# EasyEDA Pro project PrototypeBoardV2D.eprj

# Schematic Schematic1
Board Name: Board1; Create Date: 2025-06-25; Page Name: P1; Project Name: PrototypeBoardV2D; Schematic Name: Schematic1; Update Date: 2025-12-08; Company: m039; Drawn: Dmitry Mozgin; Page Size: A4; Version: V1.0
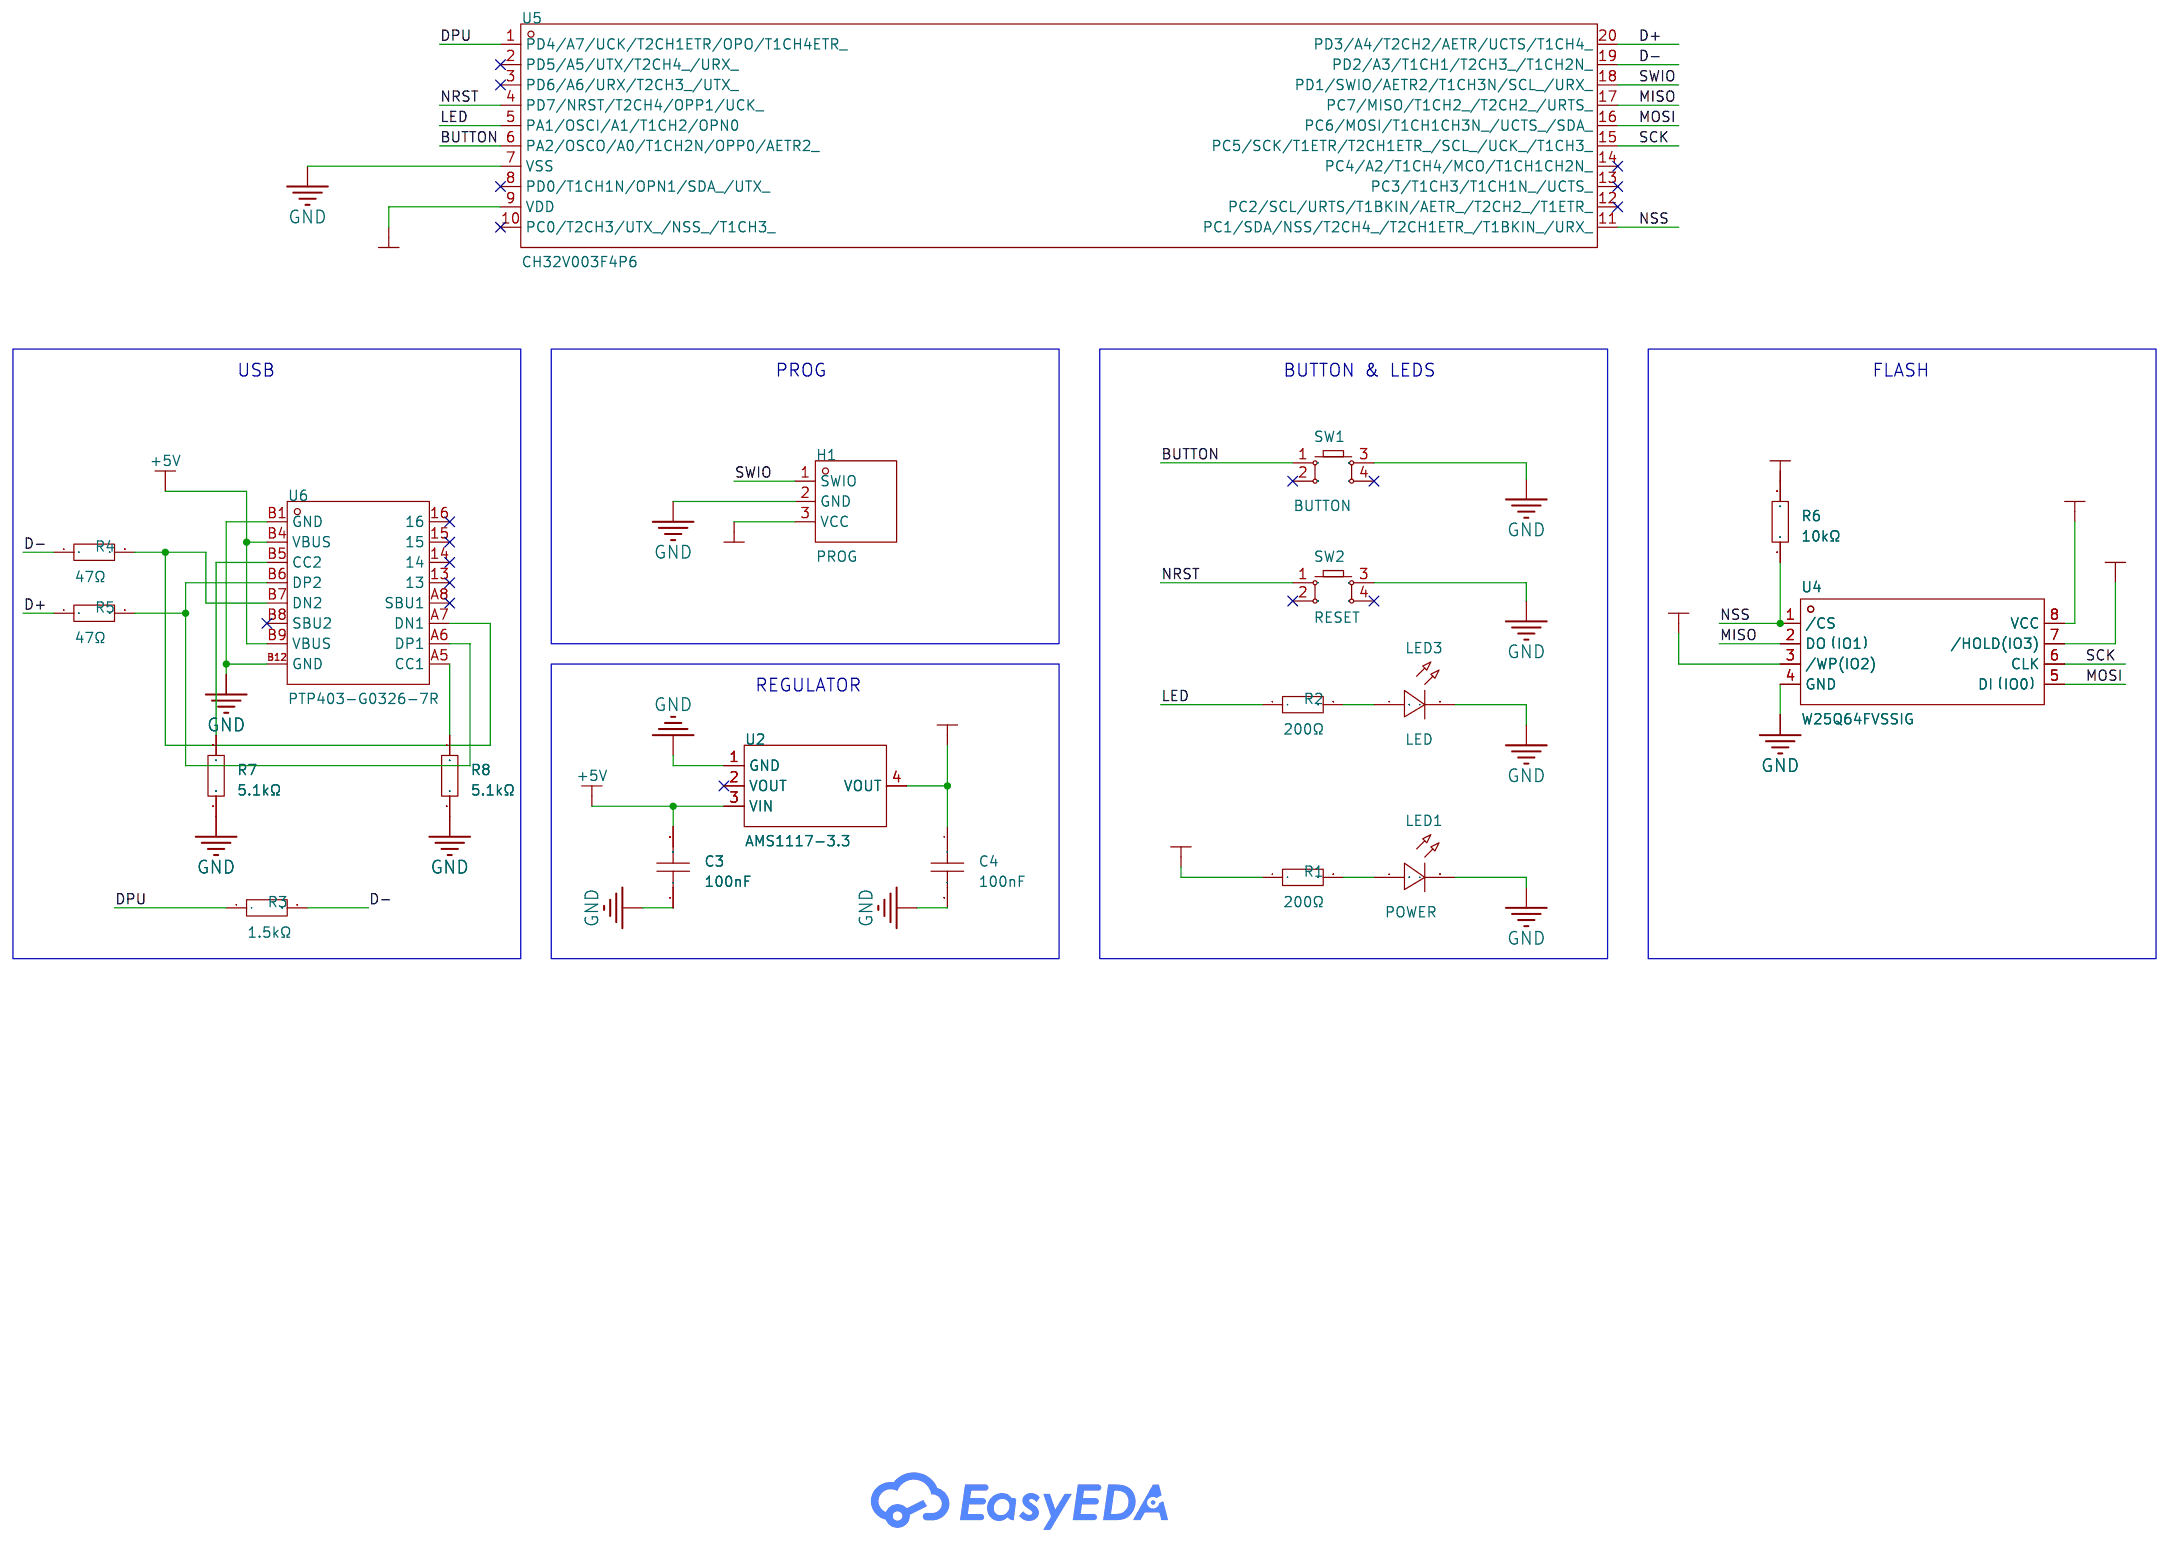
[diagram p0: schematic sheet]

## Parts
C3  100nF  [C0805]
C4  100nF  [C0805]
H1  PROG  [HDR-TH_3P-P2.54-V-M]
LED1  POWER  [LED-TH_BD3.0-P2.54-FD]
LED3  LED  [LED-TH_BD3.8-P2.54-FD_BLUE]
R1  200Ω  [R1206]
R2  200Ω  [R1206]
R3  1.5kΩ  [R1206]
R4  47Ω  [R1206]
R5  47Ω  [R1206]
R6  10kΩ  [R1206]
R7  5.1kΩ  [R1206]
R8  5.1kΩ  [R1206]
SW1  BUTTON  [KEY-TH_4P-L6.0-W6.0-P3.90-LS6.5]
SW2  RESET  [KEY-TH_4P-L6.0-W6.0-P3.90-LS6.5]
U2  AMS1117-3.3  [SOT-223-3_L6.5-W3.4-P2.30-LS7.0-BR]
U4  W25Q64FVSSIG  [SOIC-8_L5.3-W5.3-P1.27-LS8.0-BL]
U5  CH32V003F4P6  [TSSOP-20_L6.5-W4.4-P0.65-LS6.4-BL]
U6  PTP403-G0326-7R  [USB-SMD_PTP403-G0326-7R]

## Library data of the parts
C3 C4 = CAP_0805: Supplier Footprint: 0805
H1 = HDR-M_2.54_1x3P: Supplier Footprint: Through
LED1 = LED_TH-R_3mm: Supplier Footprint: Through
LED3 = LED_TH-B_3mm: Supplier Footprint: Through
R1-R8 = Res_1206: Supplier Footprint: 1206
SW1 SW2 = Key_TH_6x6x4.5: Supplier Footprint: Through
U2 = AMS1117-3.3_C6186: LCSC Part Name: 输出3.3V 1A; Supplier Part: C6186; Manufacturer: AMS; Supplier Footprint: SOT-223; JLCPCB Part Class: Basic Part; Datasheet: https://atta.szlcsc.com/upload/public/pdf/source/20180727/C6186_7A095716F0823C02F1997A905E26C086.pdf; Supplier: LCSC; Output Type: Fixed; Voltage - Supply: 16V; Output Voltage: 3.3V; Output Current: 1A; Power Supply Rejection Ratio (PSRR): 72dB@(120Hz); Voltage Dropout: 1.1V@(800mA); standby current: 5mA; Features: Over Current Protection；Over Temperature Protection; Operating Temperature: -40℃~+125℃; Output Configuration: Positive; Number of Outputs: 1
U4 = W25Q64FVSSIG: LCSC Part Name: W25Q64FVSSIG 停产; Supplier Part: C66141; Supplier Footprint: SOIC-8-208mil; JLCPCB Part Class: Extended Part; Supplier: LCSC
U5 = CH32V003F4P6: Supplier Part: C5187096; Manufacturer: WCH(南京沁恒); Supplier Footprint: TSSOP-20-175mil; JLCPCB Part Class: Extended Part; Datasheet: https://atta.szlcsc.com/upload/public/pdf/source/20250604/86DFE64B14CD7099775DB96D45CE90A6.pdf; Supplier: LCSC
U6 = USB Type-C 16P: Supplier Part: C9900000187; Supplier Footprint: USB3-TYPEC-16PIN-COM; JLCPCB Part Class: Extended Part; Supplier: LCSC

## Nets
+3.3V: C4.1 H1.3(VCC) R1.1 R6.2 U2.4(VOUT) U4.3(/WP(IO2)) U4.7(/HOLD(IO3)) U4.8(VCC) U5.9(VDD)
+5V: C3.2 U2.3(VIN) U6.B4(VBUS) U6.B9(VBUS)
GND: C3.1 C4.2 H1.2(GND) LED1.2(A) LED3.2(A) R7.1 R8.1 SW1.3 SW2.3 U2.1(GND) U4.4(GND) U5.7(VSS) U6.B1(GND) U6.B12(GND)
BUTTON: SW1.1 U5.6(PA2/OSCO/A0/T1CH2N/OPP0/AETR2_)
D+: R5.1 U5.20(PD3/A4/T2CH2/AETR/UCTS/T1CH4_)
D-: R3.2 R4.1 U5.19(PD2/A3/T1CH1/T2CH3_/T1CH2N_)
DPU: R3.1 U5.1(PD4/A7/UCK/T2CH1ETR/OPO/T1CH4ETR_)
LED: R2.1 U5.5(PA1/OSCI/A1/T1CH2/OPN0)
MISO: U4.2(DO（IO1）) U5.17(PC7/MISO/T1CH2_/T2CH2_/URTS_)
MOSI: U4.5(DI（IO0）) U5.16(PC6/MOSI/T1CH1CH3N_/UCTS_/SDA_)
NRST: SW2.1 U5.4(PD7/NRST/T2CH4/OPP1/UCK_)
NSS: R6.1 U4.1(/CS) U5.11(PC1/SDA/NSS/T2CH4_/T2CH1ETR_/T1BKIN_/URX_)
SCK: U4.6(CLK) U5.15(PC5/SCK/T1ETR/T2CH1ETR_/SCL_/UCK_/T1CH3_)
SWIO: H1.1(SWIO) U5.18(PD1/SWIO/AETR2/T1CH3N/SCL_/URX_)
$1N1276: LED1.1(C) R1.2
$1N2333: LED3.1(C) R2.2
$1N3479: R4.2 U6.A7(DN1) U6.B7(DN2)
$1N3509: R5.2 U6.A6(DP1) U6.B6(DP2)
$1N6961: R8.2 U6.A5(CC1)
Net-(R7-2): R7.2 U6.B5(CC2)

Not connected (* = marked no-connect by the designer): SW1 2* 4*; SW2 2* 4*; U2 2(VOUT)*; U5 2(PD5/A5/UTX/T2CH4_/URX_)* 3(PD6/A6/URX/T2CH3_/UTX_)* 8(PD0/T1CH1N/OPN1/SDA_/UTX_)* 10(PC0/T2CH3/UTX_/NSS_/T1CH3_)* 12(PC2/SCL/URTS/T1BKIN/AETR_/T2CH2_/T1ETR_)* 13(PC3/T1CH3/T1CH1N_/UCTS_)* 14(PC4/A2/T1CH4/MCO/T1CH1CH2N_)*; U6 13* 14* 15* 16* A8(SBU1)* B8(SBU2)*

## Notes on the sheet
- USB
- PROG
- BUTTON & LEDS
- FLASH
- REGULATOR

# Board PCB1
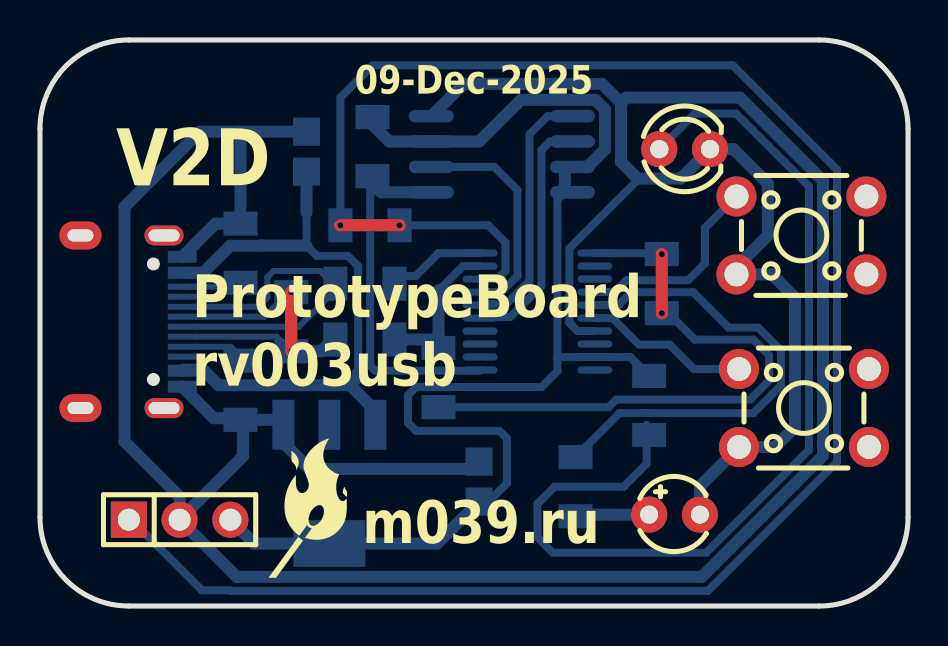
[diagram p1: board, top side]
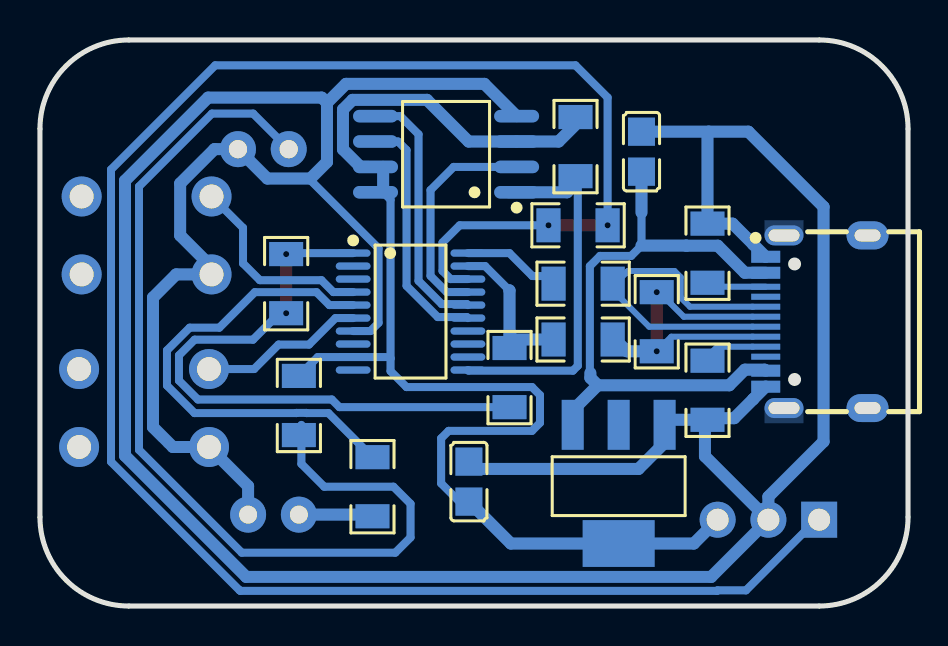
[diagram p2: board, bottom side, seen from below]

Outline 43.44 x 28.32 mm; copper layers: Top Layer, Bottom Layer. Coordinates in mm from the lower left corner of the outline.
Outline path: 0,23.88 0,4.45 arc(1.3,1.3) 4.45,0 38.99,0 arc(42.13,1.3) 43.44,4.45 43.44,23.88 arc(42.13,27.02) 38.99,28.32 4.45,28.32 arc(1.3,27.02) 0,23.88
Stack: Top Layer 0.035mm / Dielectric1 1.51mm FR4 er 4.5 / Bottom Layer 0.035mm

## Design rules (mm)
template: Custom Config
spacing copperThickness1oz (default): track to track 0.2, other pairs 0.152 to 0.3
spacing copperThickness2oz: track to track 0.203, other pairs 0.152 to 0.3
track width copperThickness1oz (default): min 0.127, default 0.6, max 2.54
track width copperThickness2oz: min 0.203, default 0.254, max 2.54
differential pair differentialPair (default): width min 0.127, default 0.254, max 2.54; gap min 0.152, default 0.152
via viaSize (default): diameter min 0.5, default 0.61, max 10; hole min 0.3, default 0.305, max 6.3

## Placement (name value [footprint] x y rotation side)
C3  100nF  [C0805]  13.34 22.73 270 bottom
C4  100nF  [C0805]  21.97 6.22 90 bottom
H1  PROG  [HDR-TH_3P-P2.54-V-M]  6.99 4.32 0 top
LED1  POWER  [LED-TH_BD3.0-P2.54-FD]  32.26 22.86 0 top
LED3  LED  [LED-TH_BD3.8-P2.54-FD_BLUE]  31.75 4.57 0 top
R1  200Ω  [R1206]  30.48 10.03 270 bottom
R2  200Ω  [R1206]  26.8 5.97 270 bottom
R3  1.5kΩ  [R1206]  19.94 11.43 90 bottom
R4  47Ω  [R1206]  16.26 13.34 180 bottom
R5  47Ω  [R1206]  16.26 16.13 180 bottom
R6  10kΩ  [R1206]  16.64 22.99 90 bottom
R7  5.1kΩ  [R1206]  16.51 19.05 0 bottom
R7#2  -  [R1206]  12.57 14.23 270 bottom
R7#3  -  [R1206]  10.03 17.65 270 bottom
R7#4  -  [R1206]  31.12 16.13 90 bottom
R8  5.1kΩ  [R1206]  10.03 10.8 90 bottom
SW1  BUTTON  [KEY-TH_4P-L6.0-W6.0-P3.90-LS6.5]  38.23 9.91 0 top
SW2  RESET  [KEY-TH_4P-L6.0-W6.0-P3.90-LS6.5]  38.1 18.54 0 top
U2  AMS1117-3.3  [SOT-223-3_L6.5-W3.4-P2.30-LS7.0-BR]  14.48 6.1 90 bottom
U4  W25Q64FVSSIG  [SOIC-8_L5.3-W5.3-P1.27-LS8.0-BL]  23.12 22.61 90 bottom
U5  CH32V003F4P6  [TSSOP-20_L6.5-W4.4-P0.65-LS6.4-BL]  24.89 14.73 270 bottom
U6  PTP403-G0326-7R  [USB-SMD_PTP403-G0326-7R]  4.57 14.23 90 bottom

## Footprints (pads in the part's own frame, mm; a bottom-side part is the same pattern mirrored in y, then rotated)
C0805
  rect 1.41x1.35 smd: 1(-1,0) 2(1,0)
HDR-TH_3P-P2.54-V-M
  rect 1.8x1.8 hole 1.1: 1(-2.54,0)
  round 1.8 hole 1.1x0.9: 2(0,0) 3(2.54,0)
KEY-TH_4P-L6.0-W6.0-P3.90-LS6.5
  round 2 hole 1.2: 1(-3.25,1.95) 2(3.25,1.95) 3(-3.25,-1.95) 4(3.25,-1.95)
LED-TH_BD3.0-P2.54-FD
  round 1.8 hole 0.914x0.9: 1(-1.27,0) 2(1.27,0)
LED-TH_BD3.8-P2.54-FD_BLUE
  round 1.8 hole 0.9: 1(-1.27,0) 2(1.27,0)
R1206
  rect 1.208x1.701 smd: 1(-1.479,0) 2(1.479,0)
SOIC-8_L5.3-W5.3-P1.27-LS8.0-BL
  oval 0.63x2.25 smd: 1(-1.905,-3.53) 2(-0.635,-3.53) 3(0.635,-3.53) 4(1.905,-3.53) 5(1.905,3.53) 6(0.635,3.53) 7(-0.635,3.53) 8(-1.905,3.53)
SOT-223-3_L6.5-W3.4-P2.30-LS7.0-BR
  rect 2.5x1.1 smd: 1(2.97,-2.3) 2(2.97,0) 3(2.97,2.3)
  rect 2.34x3.6 smd: 4(-2.97,0)
TSSOP-20_L6.5-W4.4-P0.65-LS6.4-BL
  oval 0.364x1.742 smd: 1(-2.925,-2.871) 2(-2.275,-2.871) 3(-1.625,-2.871) 4(-0.975,-2.871) 5(-0.325,-2.871) 6(0.325,-2.871) 7(0.975,-2.871) 8(1.625,-2.871) 9(2.275,-2.871) 10(2.925,-2.871) 11(2.925,2.871) 12(2.275,2.871) 13(1.625,2.871) 14(0.975,2.871) 15(0.325,2.871) 16(-0.325,2.871) 17(-0.975,2.871) 18(-1.625,2.871) 19(-2.275,2.871) 20(-2.925,2.871)
USB-SMD_PTP403-G0326-7R
  oval 1x1.95 hole 0.6x1.55: 13(-4.32,1.633) 14(4.32,1.633)
  oval 1.4x2.1 hole 0.6x1.3: 15(-4.32,-2.547) 16(4.32,-2.547)
  rect 0.3x1.45 smd: A5(-1.25,2.547) A6(-0.25,2.547) A7(0.25,2.547) A8(1.25,2.547) B5(1.75,2.547) B6(0.75,2.547) B7(-0.75,2.547) B8(-1.75,2.547)
  rect 0.6x1.45 smd: B1(3.25,2.547) B4(2.45,2.547) B9(-2.45,2.547) B12(-3.25,2.547)

## Nets
+3.3V: C4.1 H1.3 R1.1 R6.2 U2.4 U4.3 U4.7 U4.8 U5.9
+5V: C3.2 U2.3 U6.B4 U6.B9
GND: C3.1 C4.2 H1.2 LED1.2 LED3.2 R7#3.1 R8.1 SW1.3 SW2.3 U2.1 U4.4 U5.7 U6.B1 U6.B12
BUTTON: SW1.1 U5.6
D+: R5.1 U5.20
D-: R3.2 R4.1 U5.19
DPU: R3.1 R7#4.1 R7#4.2 U5.1
LED: R2.1 U5.5
MISO: U4.2 U5.17
MOSI: U4.5 U5.16
NRST: SW2.1 U5.4
NSS: R6.1 U4.1 U5.11
SCK: U4.6 U5.15
SWIO: H1.1 R7.1 R7.2 U5.18
$1N1276: LED1.1 R1.2
$1N2333: LED3.1 R2.2
$1N3479: R4.2 R7#2.1 R7#2.2 U6.A7 U6.B7
$1N3509: R5.2 U6.A6 U6.B6
$1N6957: R7#3.2 U6.B5
$1N6961: R8.2 U6.A5

Pads without a net: SW1 2 4; SW2 2 4; U2 2; U5 2 3 8 10 12 13 14; U6 13 14 15 16 A8 B8

## Via types
v1: diameter 0.61, hole 0.305, Top Layer to Bottom Layer, 6 vias

## Routing (per net, layer and track width the routed paths; a pad name or vN(x,y) marks a point on that pad's centre or on a via; arc(x,y) is an arc through that point)
+3.3V: length 64.5
  Bottom Layer w0.4: 26.26,20.7 25.89,20.33 25.89,12.39 ; 25.89,12.39 25.89,11.75 25.1,10.96 18.82,10.96 18.42,10.56 18.42,9.16 18.82,8.76 22.99,8.76 23.36,8.39 23.36,6.14 22.45,5.22 C4.1 ; 25.89,12.39 25.96,12.46 U5.9 29.54,12.46 R1.1
  Bottom Layer w0.6: 16.64,24.09 17.48,23.24 U4.3 21.99,23.24 24.07,25.33 27.79,25.33 28.27,24.85 28.27,24.73 28.28,24.73 28.28,22.85 27.4,21.97 27.03,21.97 ; C4.1 19.88,3.13 10.72,3.13 H1.3 ; 26.26,20.7 26.26,21.97
+5V: length 30.8
  Bottom Layer w0.4: 15.92,11.69 15.92,17.01 15.41,17.52 13.85,17.52 13.34,18.04 13.34,19.69
  Bottom Layer w0.6: U2.3 16.78,9.79 15.52,11.05 ; 15.52,11.05 8.94,11.05 8.16,11.83 7.17,11.83 U6.B9 ; 15.52,11.05 15.9,11.42 15.9,11.66 ; U6.B4 8.17,16.68 9.52,18.03 11.09,18.03 11.1,18.04 13.34,18.04 ; C3.2 13.34,19.69
GND: length 175.8
  Bottom Layer w0.4: 29.9,21.31 26.49,17.9 26.49,14.17 26.9,13.76 U5.7
  Bottom Layer w0.6: 35.04,16.78 34.85,16.97 36.42,18.54 36.42,21.14 34.7,22.86 LED1.2 32.06,21.39 29.9,21.39 29.08,22.22 29.08,25.18 ; 9.98,23.73 10.03,23.68 R7#3.1 8.78,19.13 7.75,18.11 7.75,18.1 7.12,17.48 U6.B1 ; 9.98,23.73 7.99,23.73 4.23,19.98 4.23,8.23 6.99,5.47 H1.2 ; 9.98,23.73 C3.1 ; 10.16,9.32 10.08,9.4 8.7,9.4 7.75,10.35 7.75,10.35 7.12,10.98 U6.B12 ; 10.16,9.32 10.16,7.49 H1.2 ; 10.16,9.32 12.18,9.32 ; 10.16,9.32 R8.1 ; LED3.2 33.02,6 SW1.3 36.79,7.96 37.78,8.95 37.78,15.43 36.62,16.59 SW2.3 ; H1.2 9.85,1.46 33.12,1.46 39.18,7.52 39.18,21.28 35.02,25.44 29.34,25.44 29.08,25.18 ; U2.1 12.18,8.17 13.49,6.86 21.61,6.86 C4.2 ; U4.4 21.2,26.13 28.12,26.13 29.08,25.18
BUTTON: length 8.3
  Bottom Layer w0.4: U5.6 28.65,14.41 29.97,13.08 31.5,13.08 32.72,11.86 SW1.1
D+: length 4.9
  Bottom Layer w0.4: 17.61,16.51 18.8,16.51 19.94,17.66 U5.20
D-: length 7.4
  Bottom Layer w0.4: 19.95,15.8 21.16,17.01 U5.19
  Bottom Layer w0.6: 19.95,15.8 19.94,15.79 19.94,13.56 19.72,13.34 17.48,13.34
DPU: length 31.2
  Top Layer w0.6: v1(31.12,17.61) v1(31.12,14.65)
  Bottom Layer w0.4: 31.37,17.86 31.17,17.66 U5.1 ; R3.1 28.45,9.95 28.83,10.33 35.53,10.33 36.48,11.28 36.48,12.54 35.7,13.33 32.78,13.33 31.37,14.73 31.37,14.91
LED: length 24.3
  Bottom Layer w0.4: R2.1 29,9.65 30.1,9.65 30.11,9.66 30.6,9.66 30.61,9.65 35.7,9.65 37.08,11.03 37.08,12.79 35.95,13.93 34.46,13.93 32.69,15.7 29.6,15.7 28.95,15.06 U5.5
MISO: length 11.7
  Bottom Layer w0.4: U5.17 23.08,15.71 23.89,16.52 23.89,20.81 22.73,21.97 19.2,21.97
MOSI: length 12.5
  Bottom Layer w0.4: 26.26,24.51 25.4,24.51 24.49,23.6 24.49,16.27 23.33,15.11 22.07,15.11 U5.16
NRST: length 10.1
  Bottom Layer w0.4: SW2.1 34.84,20.49 33.28,18.92 33.28,17.15 32.43,16.3 29.35,16.3 28.76,15.71 U5.4
NSS: length 18.8
  Bottom Layer w0.4: 16.52,21.01 16.64,21.13 ; 16.52,21.01 16.52,21.39 R6.1 ; 16.52,21.01 16.52,12.02 16.77,11.78 21.99,11.78 U5.11
  Bottom Layer w0.6: 19.97,20.7 17.06,20.7 16.64,21.13
SCK: length 11.9
  Bottom Layer w0.4: U5.15 22.07,14.46 23.53,14.46 25.09,16.02 25.09,22.82 25.52,23.24 26.26,23.24
SWIO: length 99.8
  Top Layer w0.6: v1(17.99,19.05) v1(15.03,19.05)
  Bottom Layer w0.4: U5.18 22.88,16.36 23.29,16.77 23.29,18.19 22.43,19.05 v1(17.99,19.05) ; H1.1 4.57,4.32 8.11,0.78 9.53,0.78 9.56,0.76 33.41,0.76 33.43,0.78 33.45,0.78 39.88,7.22 39.88,21.84 34.67,27.05 16.64,27.05 15.03,25.45 v1(15.03,19.05)
$1N1276: length 48.9
  Bottom Layer w0.4: 30.99,22.86 32.77,24.64 34.83,24.64 38.48,20.99 38.48,7.81 33.34,2.67 25.66,2.67 24.89,3.43 24.89,5.12 25.75,5.97 29.21,5.97 30.35,7.11 30.35,9.06
$1N2333: length 3.7
  Bottom Layer w0.6: R2.2 26.88,4.57 LED3.1
$1N3479: length 15.6
  Top Layer w0.6: v1(12.57,15.7) v1(12.57,12.75)
  Bottom Layer w0.3: v1(12.57,12.75) 11.85,13.48 7.76,13.48 ; 7.76,14.48 11.22,14.48 12.45,15.7
  Bottom Layer w0.6: v1(12.57,12.75) 14.06,12.75 14.65,13.34
$1N3509: length 16.5
  Bottom Layer w0.3: 7.76,13.98 12.95,13.98 14.65,15.68 14.65,16.13 14.02,16.77 11.69,16.77 11.37,16.45 11.37,15.44 10.91,14.98 7.76,14.98
$1N6957: length 3
  Bottom Layer w0.3: U6.B5 9.83,15.98 R7#3.2
$1N6961: length 2.8
  Bottom Layer w0.3: 10.29,12.22 9.54,12.98 7.76,12.98

## Copper pours and planes (outline as drawn; the poured copper is in the pictures)
(no net) on Bottom Layer: 5.23,9.91 7.18,9.91 7.18,9.15 5.23,9.15
(no net) on Bottom Layer: 5.23,19.31 7.18,19.31 7.18,18.55 5.23,18.55

## Text on the board
Top Silkscreen Layer: PrototypeBoard | rv003usb | V2D | 09-Dec-2025 | m039.ru
